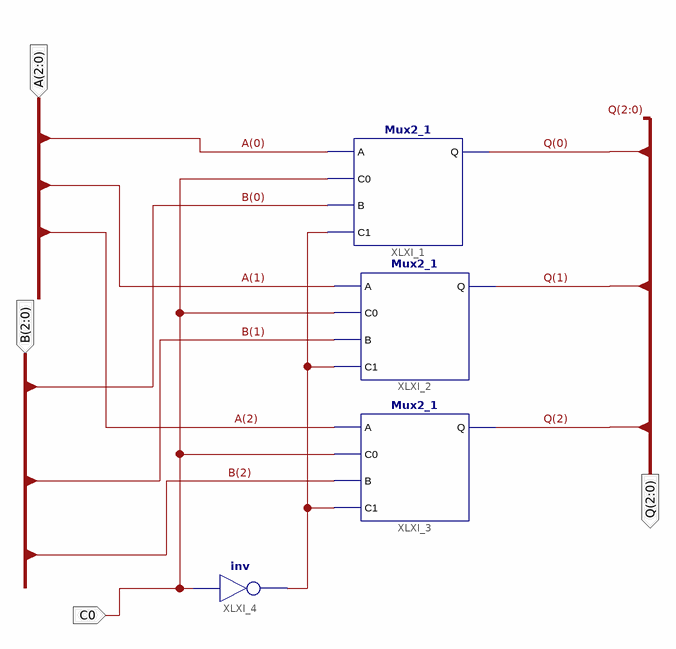
[diagram p0: schematic sheet 1]
// Xilinx ISE schematic Mux_2_3.sch (spartan3e) as structural Verilog: 4 symbols, 4 ports
module Mux_2_3 (
  input  C0,
  input  [2:0] A,
  input  [2:0] B,
  output [2:0] Q
);

  wire XLXN_6;

  Mux2_1 XLXI_1 (.A(A[0]), .B(B[0]), .C0(C0), .C1(XLXN_6), .Q(Q[0]));
  Mux2_1 XLXI_2 (.A(A[1]), .B(B[1]), .C0(C0), .C1(XLXN_6), .Q(Q[1]));
  Mux2_1 XLXI_3 (.A(A[2]), .B(B[2]), .C0(C0), .C1(XLXN_6), .Q(Q[2]));
  not XLXI_4 (XLXN_6, C0);
endmodule
